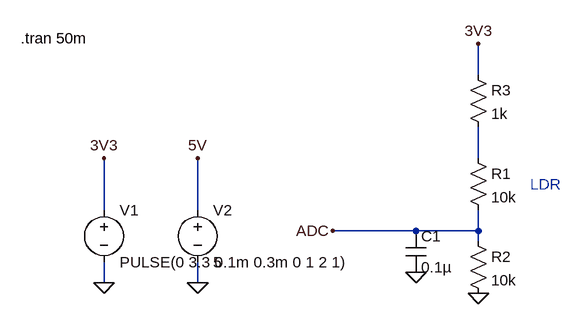
[diagram p0: schematic LDR.asc]
LDR.asc, the LTspice schematic file:
Version 4
SHEET 1 880 680
WIRE 640 -160 640 -208
WIRE 640 -32 640 -80
WIRE 64 48 64 -32
WIRE 208 48 208 -32
WIRE 544 80 416 80
WIRE 640 80 640 48
WIRE 640 80 544 80
WIRE 640 96 640 80
WIRE 64 160 64 128
WIRE 208 160 208 128
FLAG 64 -32 3V3
FLAG 208 160 0
FLAG 208 -32 5V
FLAG 64 160 0
FLAG 640 -208 3V3
FLAG 640 176 0
FLAG 416 80 ADC
FLAG 544 144 0
SYMBOL voltage 64 32 R0
WINDOW 123 0 0 Left 0
WINDOW 39 24 124 Left 2
SYMATTR InstName V1
SYMATTR Value PULSE(0 3.3 0.1m 0.3m 0 1 2 1)
SYMBOL voltage 208 32 R0
WINDOW 123 0 0 Left 0
WINDOW 39 0 0 Left 0
SYMATTR InstName V2
SYMATTR Value 5
SYMBOL res 624 -48 R0
SYMATTR InstName R1
SYMATTR Value 10k
SYMBOL res 624 80 R0
SYMATTR InstName R2
SYMATTR Value 10k
SYMBOL cap 528 80 R0
SYMATTR InstName C1
SYMATTR Value 0.1µ
SYMBOL res 624 -176 R0
SYMATTR InstName R3
SYMATTR Value 1k
TEXT -64 -216 Left 2 !.tran 50m
TEXT 720 8 Left 2 ;LDR

The netlist it stands for:
* LDR.asc
V1 3V3 0 PULSE(0 3.3 0.1m 0.3m 0 1 2 1)
V2 5V 0 5
R1 N001 ADC 10k
R2 ADC 0 10k
C1 ADC 0 0.1µ
R3 3V3 N001 1k
.tran 50m
* LDR
.backanno
.end

* Results of the author's LTspice run, read from the files saved beside the schematic
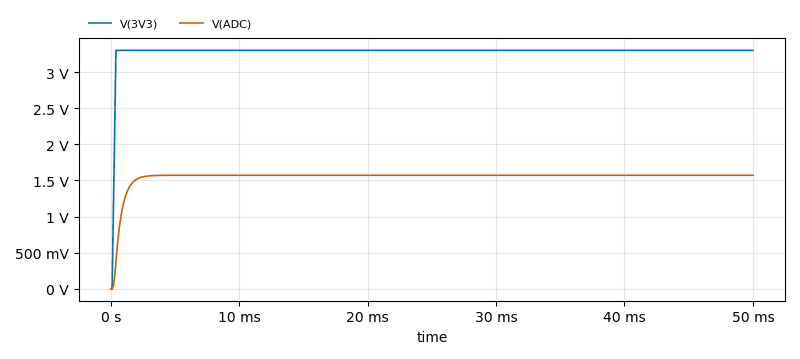
[diagram p1: Transient Analysis of LDR.asc, plotted from the saved traces]
* Transient Analysis, 1 run:
*   V(3V3): min 0 V, max 3.3 V, average 3.283 V, rms 3.29 V, last 3.3 V
*   V(ADC): min 0 V, max 1.571 V, average 1.547 V, rms 1.555 V, last 1.571 V